# EAGLE design first_try (EAGLE 7.1.0)
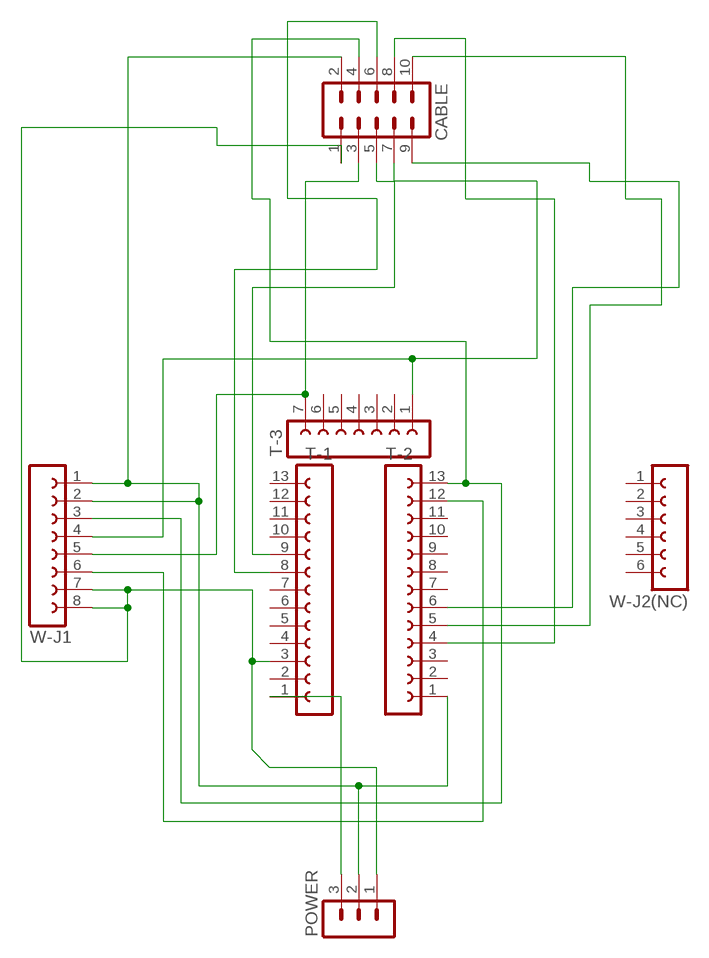
[diagram p0: schematic, sheet 1]

## Parts
CABLE  MA05-2  [MA05-2]
POWER  MA03-1  [MA03-1]
T-1  FE13-1  [FE13]
T-2  FE13-1  [FE13]
T-3  FE07-1  [FE07]
W-J1  FE08-1  [FE08]
W-J2(NC)  FE06-1  [FE06]

## Nets
3.3V: CABLE.1 POWER.1 T-1.3 W-J1.7 W-J1.8
GND: CABLE.2 POWER.2 T-2.1 W-J1.1 W-J1.2
MISO: CABLE.7 T-3.1 W-J1.4
MOSI: CABLE.4 T-2.13 W-J1.3
N$1: CABLE.5 T-1.9
N$2: CABLE.6 T-1.8
N$3: CABLE.10 T-2.5
N$4: CABLE.8 T-2.4
N$5: CABLE.9 T-2.6
SCLK: CABLE.3 T-3.7 W-J1.5
SCSN: T-2.12 W-J1.6
V_IN: POWER.3 T-1.1
Unconnected: T-1.2 T-1.4 T-1.5 T-1.6 T-1.7 T-1.10 T-1.11 T-1.12 T-1.13 T-2.2 T-2.3 T-2.7 T-2.8 T-2.9 T-2.10 T-2.11 T-3.2 T-3.3 T-3.4 T-3.5 T-3.6 W-J2(NC).1 W-J2(NC).2 W-J2(NC).3 W-J2(NC).4 W-J2(NC).5 W-J2(NC).6

## Library data of the parts
CABLE = con-lstb:MA05-2: PIN HEADER; OC_FARNELL: unknown; OC_NEWARK: unknown
POWER = con-lstb:MA03-1: PIN HEADER; OC_FARNELL: unknown; OC_NEWARK: unknown
T-1 T-2 = con-lsta:FE13-1: FEMALE HEADER; OC_FARNELL: unknown; OC_NEWARK: unknown
T-3 = con-lsta:FE07-1: FEMALE HEADER; OC_FARNELL: unknown; OC_NEWARK: unknown
W-J1 = con-lsta:FE08-1: FEMALE HEADER; OC_FARNELL: unknown; OC_NEWARK: unknown
W-J2(NC) = con-lsta:FE06-1: FEMALE HEADER; OC_FARNELL: unknown; OC_NEWARK: unknown

## Board
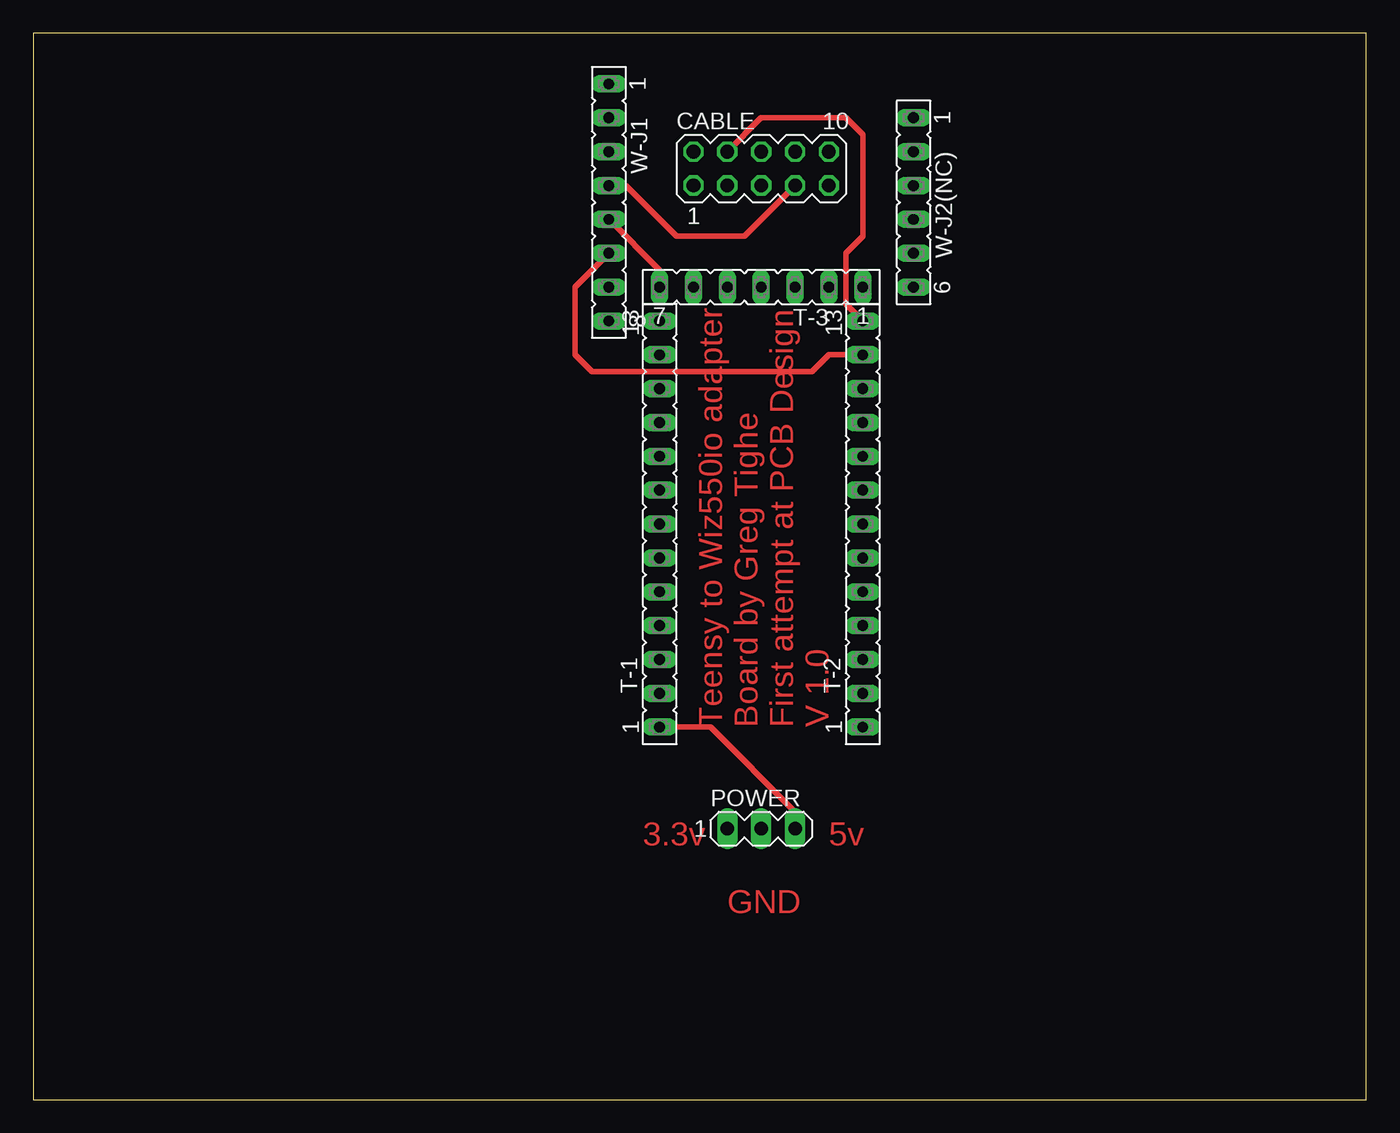
[diagram p1: board, top side]
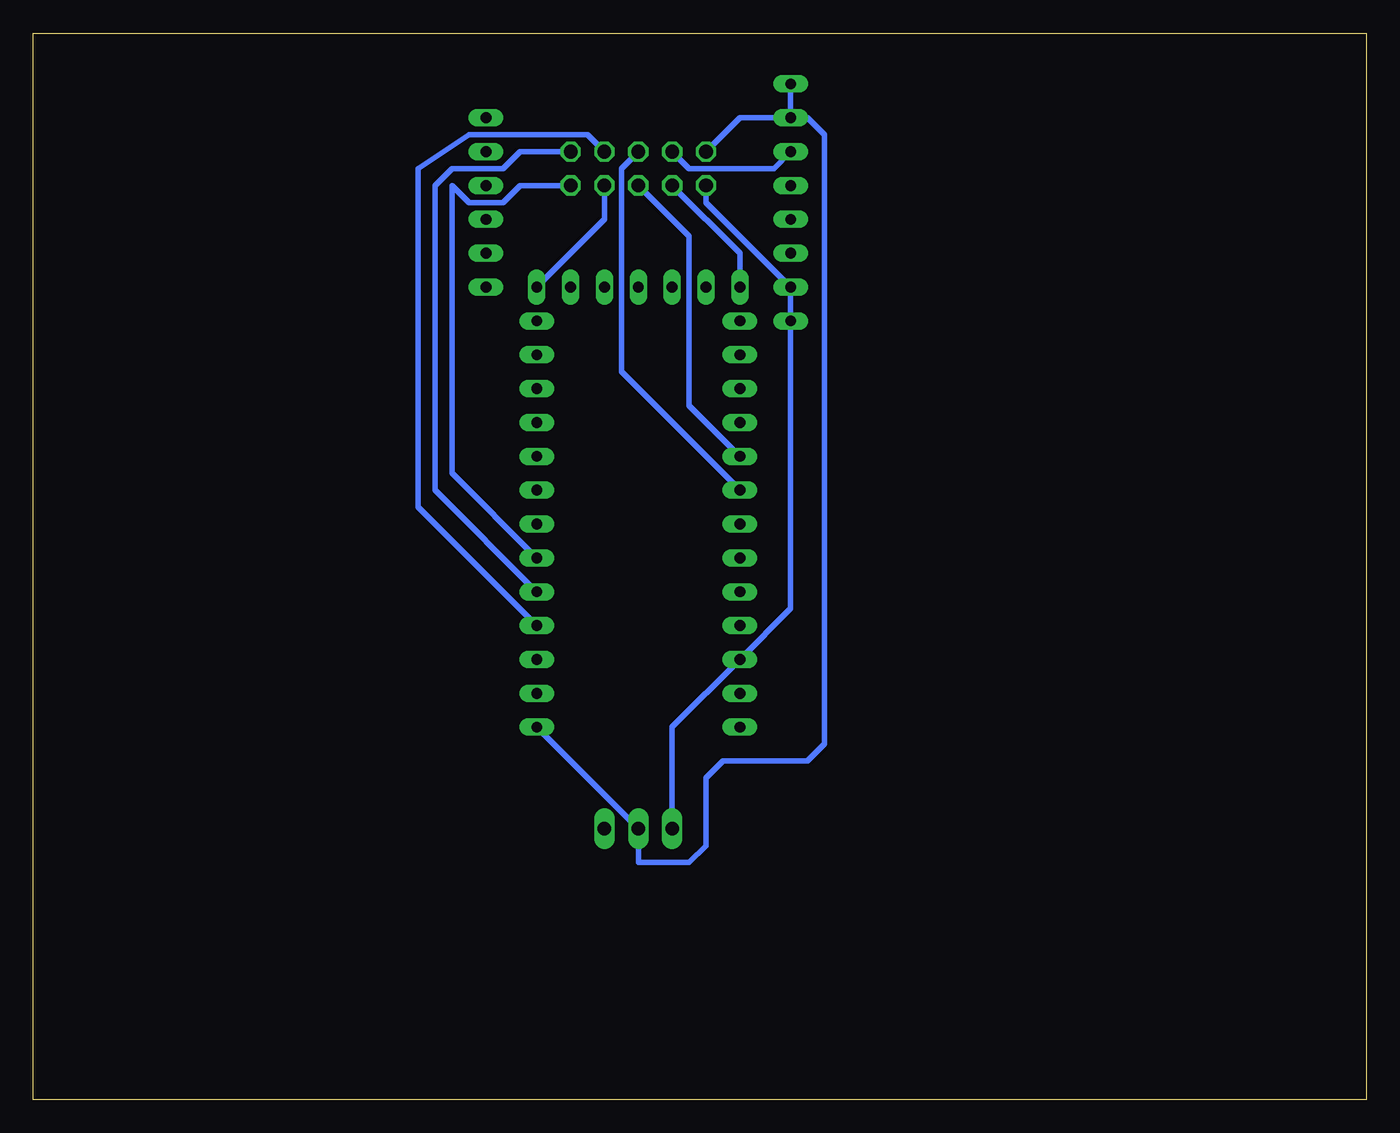
[diagram p2: board, bottom side, seen from below]

Size 100 x 80 mm. Coordinates in mm from the lower left corner, seen from the top.
Outline: 0,0 100,0 100,80 0,80 0,0
Copper layers (1*16): Top 0.035mm / dielectric 1.5mm / Bottom 0.035mm
Design rules "default": minimum track width 10mil, minimum drill 24mil, track to track 8mil, track to pad 8mil, pad to pad 8mil, via to via 8mil, smd to smd 8mil, copper to edge 40mil, drill to drill 8mil, minimum pad ring 10mil, minimum via ring 8mil, stop-mask expansion 4mil, vias tented up to drill 0mil, thermal gap 10mil

### Footprints (pad centres in the part's own frame; a part is rotated, then mirrored left to right if it is on the bottom)
MA05-2 = drill 1.016 octagon: 1 -5.08,-1.27; 2 -5.08,1.27; 3 -2.54,-1.27; 4 -2.54,1.27; 5 0,-1.27; 6 0,1.27; 7 2.54,-1.27; 8 2.54,1.27; 9 5.08,-1.27; 10 5.08,1.27
MA03-1 = drill 1.016 long: 1 -2.54,0; 2 0,0; 3 2.54,0
FE13 = drill 0.813 long: 1 -15.24,0; 2 -12.7,0; 3 -10.16,0; 4 -7.62,0; 5 -5.08,0; 6 -2.54,0; 7 0,0; 8 2.54,0; 9 5.08,0; 10 7.62,0; 11 10.16,0; 12 12.7,0; 13 15.24,0
FE07 = drill 0.813 long: 1 -7.62,0; 2 -5.08,0; 3 -2.54,0; 4 0,0; 5 2.54,0; 6 5.08,0; 7 7.62,0
FE08 = drill 0.813 long: 1 -8.89,0; 2 -6.35,0; 3 -3.81,0; 4 -1.27,0; 5 1.27,0; 6 3.81,0; 7 6.35,0; 8 8.89,0
FE06 = drill 0.813 long: 1 -6.35,0; 2 -3.81,0; 3 -1.27,0; 4 1.27,0; 5 3.81,0; 6 6.35,0

### Placement (x,y rotation side)
CABLE  54.61,69.85 0 top
POWER  54.61,20.32 0 top
T-1  46.99,43.18 90 top
T-2  62.23,43.18 90 top
T-3  54.61,60.96 180 top
W-J1  43.18,67.31 270 top
W-J2(NC)  66.04,67.31 270 top

### Tracks (layer width: path | path; a pad name or v marks a point on that pad's centre or on a via)
3.3V
  Bottom 0.406: POWER.1 52.07,27.94 T-1.3 43.18,36.83 W-J1.8 W-J1.7 49.53,67.31 CABLE.1
GND
  Bottom 0.406: W-J1.1 W-J1.2 | W-J1.2 41.91,73.66 40.64,72.39 40.64,26.67 41.91,25.4 48.26,25.4 49.53,24.13 49.53,19.05 50.8,17.78 54.61,17.78 POWER.2 T-2.1 | W-J1.2 46.99,73.66 CABLE.2
MISO
  Top 0.406: W-J1.4 44.45,68.58 48.26,64.77 53.34,64.77 CABLE.7
  Bottom 0.406: CABLE.7 57.15,66.04 T-3.1
MOSI
  Top 0.406: CABLE.4 54.61,73.66 60.96,73.66 62.23,72.39 62.23,64.77 60.96,63.5 60.96,59.69 T-2.13
  Bottom 0.406: W-J1.3 44.45,69.85 50.8,69.85 CABLE.4
N$1
  Bottom 0.406: CABLE.5 50.8,64.77 50.8,52.07 T-1.9
N$2
  Bottom 0.406: CABLE.6 55.88,69.85 55.88,54.61 T-1.8
N$3
  Bottom 0.406: CABLE.10 63.5,71.12 64.77,69.85 68.58,69.85 69.85,68.58 69.85,45.72 T-2.5
N$4
  Bottom 0.406: CABLE.8 58.42,72.39 67.31,72.39 71.12,69.85 71.12,44.45 T-2.4
N$5
  Bottom 0.406: CABLE.9 63.5,68.58 64.77,67.31 67.31,67.31 68.58,68.58 68.58,46.99 T-2.6
SCLK
  Top 0.406: W-J1.5 46.99,62.23 T-3.7
  Bottom 0.406: T-3.7 46.99,63.5 CABLE.3
SCSN
  Top 0.406: W-J1.6 40.64,60.96 40.64,55.88 41.91,54.61 58.42,54.61 59.69,55.88 T-2.12
V_IN
  Top 0.406: POWER.3 57.15,21.59 50.8,27.94 T-1.1

### Text on the board
Top: Teensy to Wiz550io adapter / Board by Greg Tighe / First attempt at PCB Design / V 1.0 | 3.3v | 5v | GND